# EAGLE design music_visualizer (EAGLE 7.2.0)
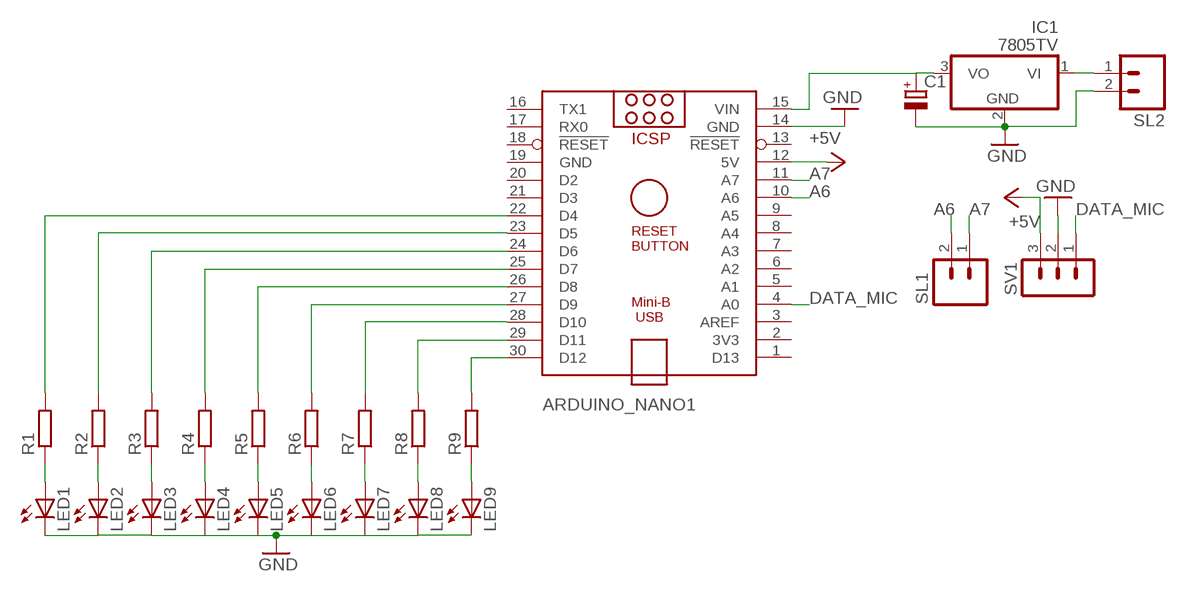
[diagram p0: schematic, sheet 1]

## Parts
ARDUINO_NANO1  ARDUINO_NANO  [ARDUINO_NANO]
C1  CPOL-EUE2.5-7  [E2,5-7]
IC1  7805TV  [TO220V]
LED1  LED5MM  [LED5MM]
LED2  LED5MM  [LED5MM]
LED3  LED5MM  [LED5MM]
LED4  LED5MM  [LED5MM]
LED5  LED5MM  [LED5MM]
LED6  LED5MM  [LED5MM]
LED7  LED5MM  [LED5MM]
LED8  LED5MM  [LED5MM]
LED9  LED5MM  [LED5MM]
R1  R-EU_0207/10  [0207/10]
R2  R-EU_0207/10  [0207/10]
R3  R-EU_0207/10  [0207/10]
R4  R-EU_0207/10  [0207/10]
R5  R-EU_0207/10  [0207/10]
R6  R-EU_0207/10  [0207/10]
R7  R-EU_0207/10  [0207/10]
R8  R-EU_0207/10  [0207/10]
R9  R-EU_0207/10  [0207/10]
SL1  M02  [02P]
SL2  M02  [02P]
SV1  MA03-1  [MA03-1]

## Nets
+5V: ARDUINO_NANO1.12(5V) SV1.3
A6: ARDUINO_NANO1.10(A6) SL1.2
A7: ARDUINO_NANO1.11(A7) SL1.1
DATA_MIC: ARDUINO_NANO1.4(A0) SV1.1
GND: ARDUINO_NANO1.14(GND) C1.- IC1.2(GND) LED1.K(C) LED2.K(C) LED3.K(C) LED4.K(C) LED5.K(C) LED6.K(C) LED7.K(C) LED8.K(C) LED9.K(C) SL2.2 SV1.2
N$1: LED1.A R1.1
N$2: ARDUINO_NANO1.30(D12) R9.2
N$3: ARDUINO_NANO1.29(D11) R8.2
N$4: ARDUINO_NANO1.28(D10) R7.2
N$5: ARDUINO_NANO1.27(D9) R6.2
N$6: ARDUINO_NANO1.26(D8) R5.2
N$7: ARDUINO_NANO1.25(D7) R4.2
N$8: ARDUINO_NANO1.24(D6) R3.2
N$9: ARDUINO_NANO1.23(D5) R2.2
N$10: ARDUINO_NANO1.22(D4) R1.2
N$11: LED2.A R2.1
N$12: LED3.A R3.1
N$13: LED4.A R4.1
N$14: LED5.A R5.1
N$15: LED6.A R6.1
N$16: LED7.A R7.1
N$17: LED8.A R8.1
N$18: LED9.A R9.1
N$19: ARDUINO_NANO1.15(VIN) C1.+ IC1.3(VO)
N$21: IC1.1(VI) SL2.1
Unconnected: ARDUINO_NANO1.1(D13) ARDUINO_NANO1.2(3V3) ARDUINO_NANO1.3(AREF) ARDUINO_NANO1.5(A1) ARDUINO_NANO1.6(A2) ARDUINO_NANO1.7(A3) ARDUINO_NANO1.8(A4) ARDUINO_NANO1.9(A5) ARDUINO_NANO1.13(!RESET) ARDUINO_NANO1.16(TX1) ARDUINO_NANO1.17(RX0) ARDUINO_NANO1.18(!RESET) ARDUINO_NANO1.20(D2) ARDUINO_NANO1.21(D3)

## Power pins joined to a net without a drawn wire
GND: ARDUINO_NANO1.19(GND)

## Library data of the parts
ARDUINO_NANO1 = ArduinoNanoV30:ARDUINO_NANO: Arduino Nano V3.0 Overview: The Arduino Nano is a small, complete, and breadboard-friendly board based on the ATmega328 (Arduino Nano 3.x) or ATmega168 (Arduino Nano 2.x). It has more or less the same functionality of the Arduino Duemilanove, but in a different package. It lacks only a DC power jack, and works with a Mini-B USB cable instead of a standard one. The Nano was designed and is being produced by Gravitech. Specifications: Microcontroller Atmel ATmega168 or ATmega328 Operating Voltage (logic level) 5 V Input Voltage (recommended) 7-12 V Input Voltage (limits) 6-20 V Digital I/O Pins 14 (of which 6 provide PWM output) Analog Input Pins 8 DC Current per I/O Pin 40 mA Flash Memory 16 KB (ATmega168) or 32 KB (ATmega328) of which 2 KB used by bootloader SRAM 1 KB (ATmega168) or 2 KB (ATmega328) EEPROM 512 bytes (ATmega168) or 1 KB (ATmega328) Clock Speed 16 MHz Dimensions 0.73" x 1.70" Length 45 mm Width 18 mm Weigth 5 g Power: The Arduino Nano can be powered via the Mini-B USB connection, 6-20V unregulated external power supply (pin 30), or 5V regulated external power supply (pin 27). The power source is automatically selected to the highest voltage source. Memory: The ATmega168 has 16 KB of flash memory for storing code (of which 2 KB is used for the bootloader); the ATmega328 has 32 KB, (also with 2 KB used for the bootloader). The ATmega168 has 1 KB of SRAM and 512 bytes of EEPROM (which can be read and written with the EEPROM library); the ATmega328 has 2 KB of SRAM and 1 KB of EEPROM. Input and Output: Each of the 14 digital pins on the Nano can be used as an input or output, using pinMode(), digitalWrite(), and digitalRead() functions. They operate at 5 volts. Each pin can provide or receive a maximum of 40 mA and has an internal pull-up resistor (disconnected by default) of 20-50 kOhms. In addition, some pins have specialized functions. Visit Arduino - ArduinoBoardNano <https://www.arduino.cc/en/Main/ArduinoBoardNano>
C1 = resistor:CPOL-EU: POLARIZED CAPACITOR, European symbol
IC1 = linear:78*: Positive VOLTAGE REGULATOR Source: http://cache.national.com/ds/LM/LM78L05.pdf http://www.fairchildsemi.com/ds/LM/LM7805.pdf
LED1-LED9 = led:LED: LED OSRAM: - CHIPLED LG R971, LG N971, LY N971, LG Q971, LY Q971, LO R971, LY R971 LH N974, LH R974 LS Q976, LO Q976, LY Q976 LO Q996 - Hyper CHIPLED LW Q18S LB Q993, LB Q99A, LB R99A - SideLED LS A670, LO A670, LY A670, LG A670, LP A670 LB A673, LV A673, LT A673, LW A673 LH A674 LY A675 LS A676, LA A676, LO A676, LY A676, LW A676 LS A679, LY A679, LG A679 - Hyper Micro SIDELED® LS Y876, LA Y876, LO Y876, LY Y876 LT Y87S - SmartLED LW L88C, LW L88S LB L89C, LB L89S, LG L890 LS L89K, LO L89K, LY L89K LS L896, LA L896, LO L896, LY L896 - TOPLED LS T670, LO T670, LY T670, LG T670, LP T670 LSG T670, LSP T670, LSY T670, LOP T670, LYG T670 LG T671, LOG T671, LSG T671 LB T673, LV T673, LT T673, LW T673 LH T674 LS T676, LA T676, LO T676, LY T676, LB T676, LH T676, LSB T676, LW T676 LB T67C, LV T67C, LT T67C, LS T67K, LO T67K, LY T67K, LW E67C LS E67B, LA E67B, LO E67B, LY E67B, LB E67C, LV E67C, LT E67C LW T67C LS T679, LY T679, LG T679 LS T770, LO T770, LY T770, LG T770, LP T770 LB T773, LV T773, LT T773, LW T773 LH T774 LS E675, LA E675, LY E675, LS T675 LS T776, LA T776, LO T776, LY T776, LB T776 LHGB T686 LT T68C, LB T68C - Hyper Mini TOPLED® LB M676 - Mini TOPLED Santana® LG M470 LS M47K, LO M47K, LY M47K Source: http://www.osram.convergy.de LUXEON: - LUMILED® LXK2-PW12-R00, LXK2-PW12-S00, LXK2-PW14-U00, LXK2-PW14-V00 LXK2-PM12-R00, LXK2-PM12-S00, LXK2-PM14-U00 LXK2-PE12-Q00, LXK2-PE12-R00, LXK2-PE12-S00, LXK2-PE14-T00, LXK2-PE14-U00 LXK2-PB12-K00, LXK2-PB12-L00, LXK2-PB12-M00, LXK2-PB14-N00, LXK2-PB14-P00, LXK2-PB14-Q00 LXK2-PR12-L00, LXK2-PR12-M00, LXK2-PR14-Q00, LXK2-PR14-R00 LXK2-PD12-Q00, LXK2-PD12-R00, LXK2-PD12-S00 LXK2-PH12-R00, LXK2-PH12-S00 LXK2-PL12-P00, LXK2-PL12-Q00, LXK2-PL12-R00 Source: www.luxeon.com KINGBRIGHT: KA-3528ASYC Source: www.kingbright.com
R1-R9 = resistor:R-EU_: RESISTOR, European symbol
SL1 SL2 = con-amp-quick:M02: AMP QUICK CONNECTOR; OC_FARNELL: unknown; OC_NEWARK: unknown
SV1 = con-lstb:MA03-1: PIN HEADER; OC_FARNELL: unknown; OC_NEWARK: unknown

## Board
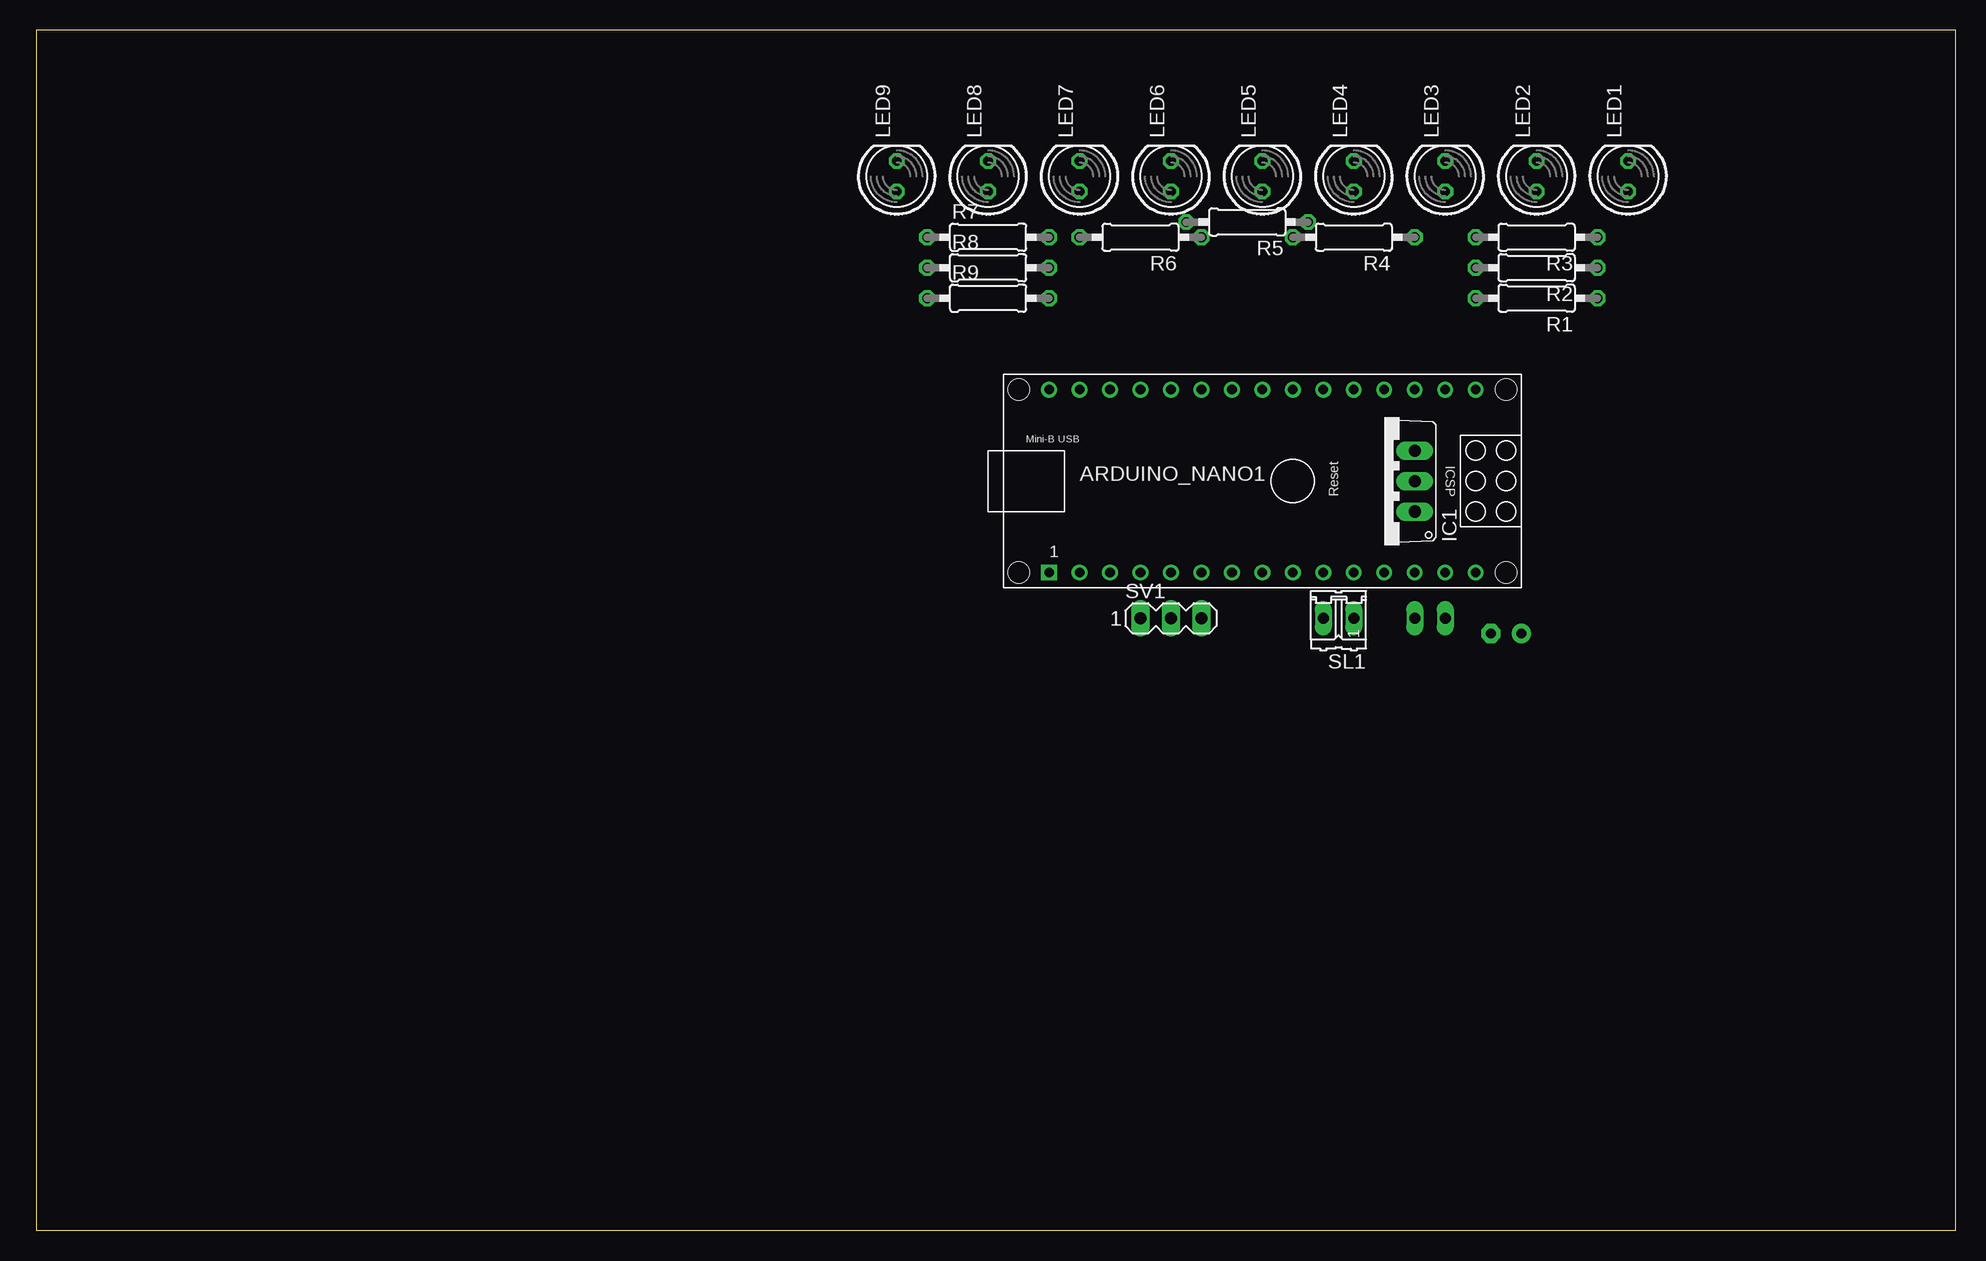
[diagram p1: board, top side]
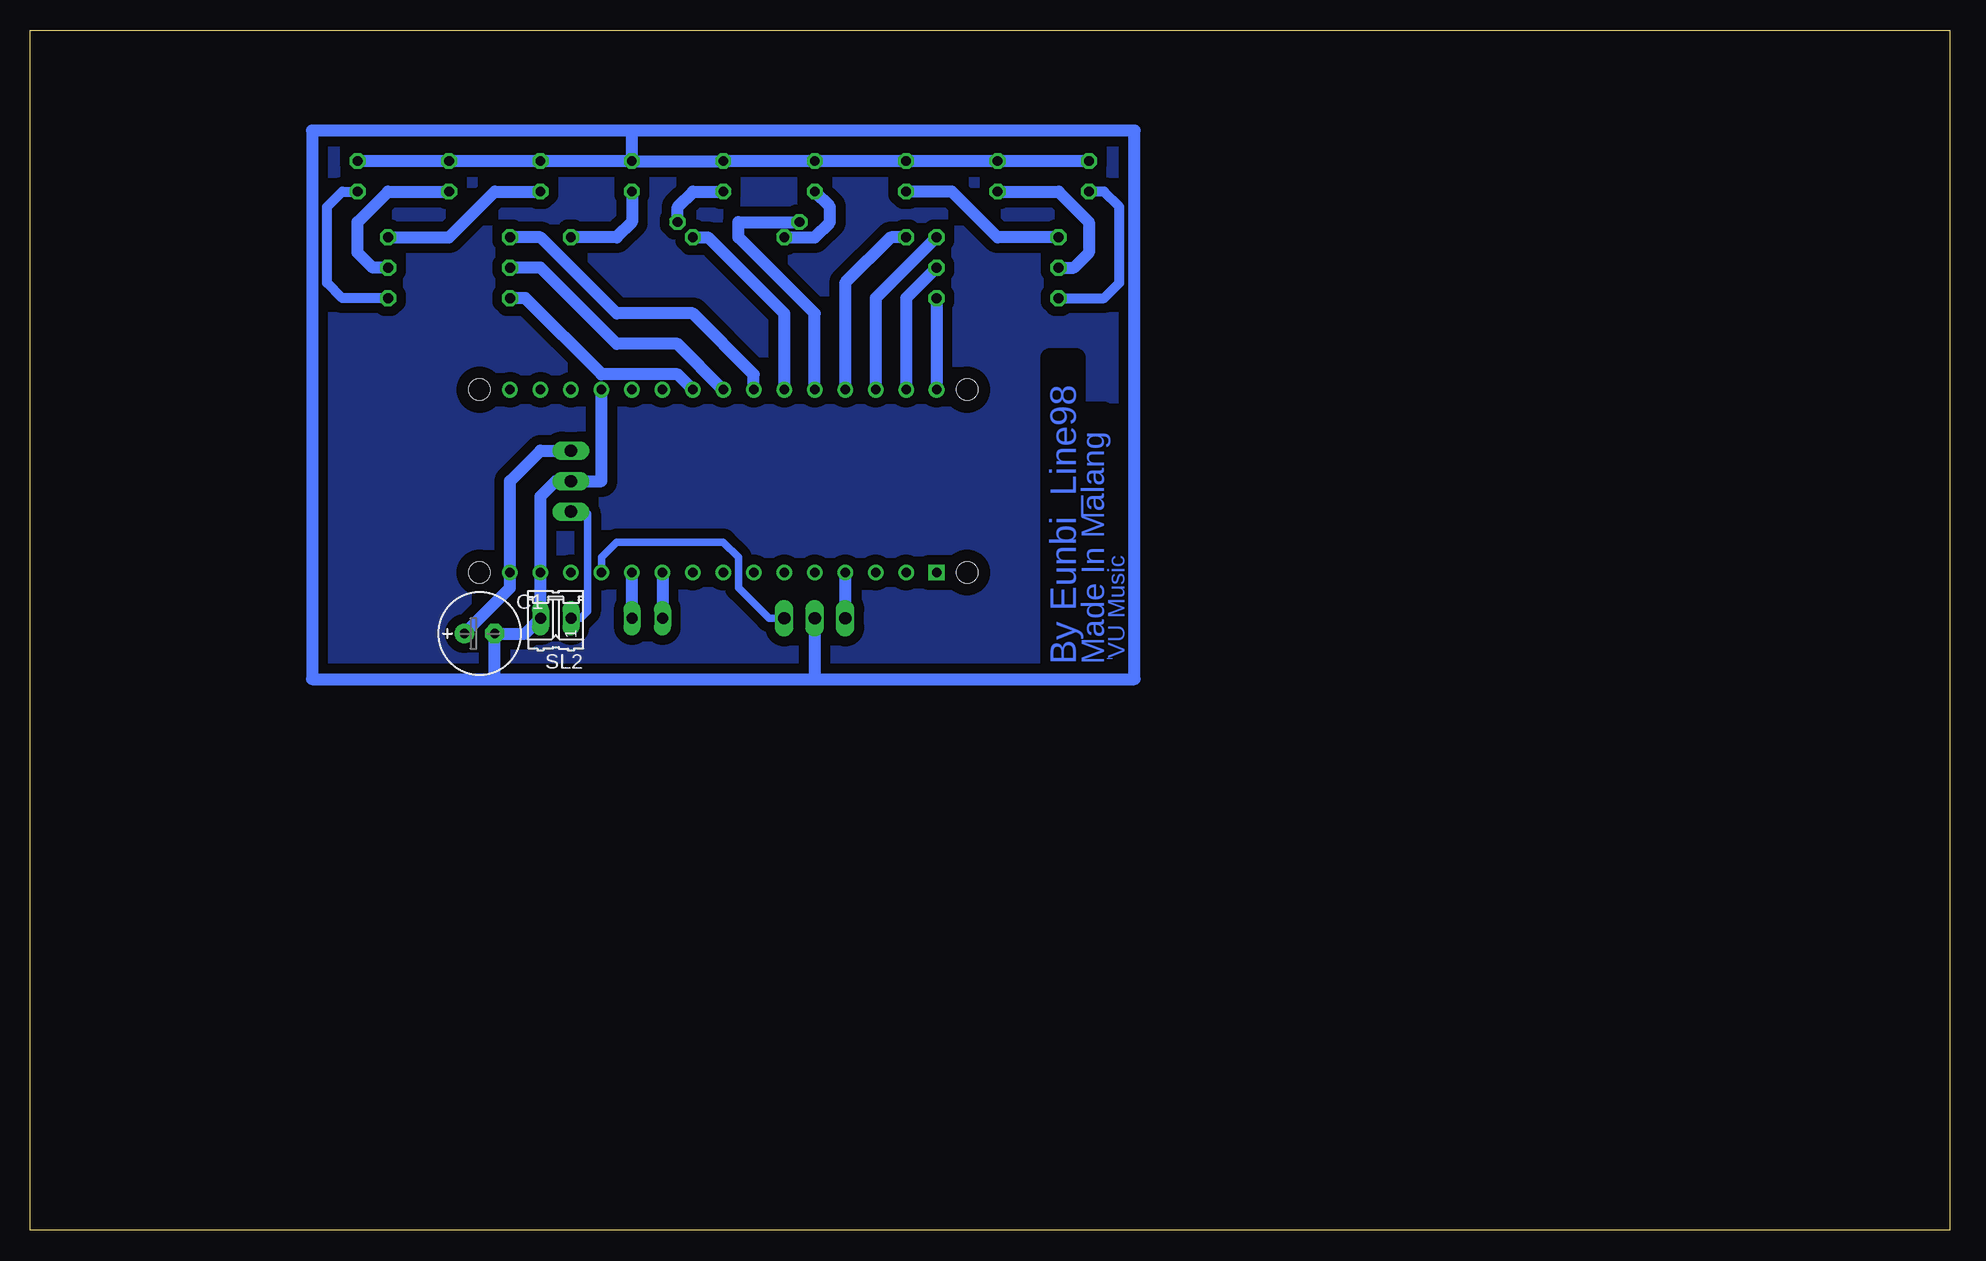
[diagram p2: board, bottom side, seen from below]

Size 160 x 100 mm. Coordinates in mm from the lower left corner, seen from the top.
Outline: 0,0 160,0 160,100 0,100 0,0
Copper layers (1*16): Top 0.035mm / dielectric 1.5mm / Bottom 0.035mm
Design rules "default": minimum track width 10mil, minimum drill 24mil, track to track 8mil, track to pad 8mil, pad to pad 8mil, via to via 8mil, smd to smd 8mil, copper to edge 40mil, drill to drill 8mil, minimum pad ring 10mil, minimum via ring 8mil, stop-mask expansion 4mil, vias tented up to drill 0mil, thermal gap 10mil

### Footprints (pad centres in the part's own frame; a part is rotated, then mirrored left to right if it is on the bottom)
ARDUINO_NANO = drill 0.8 square: 1 -20.32,-7.62 | drill 0.8: 2 -17.78,-7.62; 3 -15.24,-7.62; 4 -12.7,-7.62; 5 -10.16,-7.62; 6 -7.62,-7.62; 7 -5.08,-7.62; 8 -2.54,-7.62; 9 0,-7.62; 10 2.54,-7.62; 11 5.08,-7.62; 12 7.62,-7.62; 13 10.16,-7.62; 14 12.7,-7.62; 15 15.24,-7.62; 16 15.24,7.62; 17 12.7,7.62; 18 10.16,7.62; 19 7.62,7.62; 20 5.08,7.62; 21 2.54,7.62; 22 0,7.62; 23 -2.54,7.62; 24 -5.08,7.62; 25 -7.62,7.62; 26 -10.16,7.62; 27 -12.7,7.62; 28 -15.24,7.62; 29 -17.78,7.62; 30 -20.32,7.62 | hole 1.778: -22.86,-7.62; -22.86,7.62; 17.78,7.62; 17.78,-7.62
E2,5-7 = drill 0.813 pad 1.6: + -1.27,0 | drill 0.813 pad 1.6 octagon: - 1.27,0
TO220V = drill 1.016 long: 1 -2.54,-2.54; 2 0,-2.54; 3 2.54,-2.54
LED5MM = drill 0.813 octagon: A -1.27,0; K 1.27,0
0207/10 = drill 0.813 octagon: 1 -5.08,0; 2 5.08,0
02P = drill 0.914 long: 1 -1.27,0; 2 1.27,0
MA03-1 = drill 1.016 long: 1 -2.54,0; 2 0,0; 3 2.54,0

### Placement (x,y rotation side)
ARDUINO_NANO1  104.75,62.41 0 top
C1  122.53,49.71 0 bottom
IC1  112.37,62.41 90 top
LED1  132.69,87.81 90 top
LED2  125.07,87.81 90 top
LED3  117.45,87.81 90 top
LED4  109.83,87.81 90 top
LED5  102.21,87.81 90 top
LED6  94.59,87.81 90 top
LED7  86.97,87.81 90 top
LED8  79.35,87.81 90 top
LED9  71.73,87.81 90 top
R1  125.07,77.65 180 top
R2  125.07,80.19 180 top
R3  125.07,82.73 180 top
R4  109.83,82.73 180 top
R5  100.94,84 180 top
R6  92.05,82.73 180 top
R7  79.35,82.73 0 top
R8  79.35,80.19 0 top
R9  79.35,77.65 0 top
SL1  108.56,50.98 180 top
SL2  116.18,50.98 180 bottom
SV1  94.59,50.98 0 top

### Tracks (layer width: path | path; a pad name or v marks a point on that pad's centre or on a via)
+5V
  Bottom 0.61: SV1.3 98.4,50.98 100.94,53.52 100.94,56.06 102.21,57.33 111.1,57.33 112.37,56.06 ARDUINO_NANO1.12
A6
  Bottom 1.016: ARDUINO_NANO1.10 SL1.2
A7
  Bottom 1.016: SL1.1 ARDUINO_NANO1.11
DATA_MIC
  Bottom 1.016: ARDUINO_NANO1.4 SV1.1
GND
  Bottom 1.016: LED9.K LED8.K LED7.K LED6.K LED5.K LED4.K | LED4.K LED3.K LED2.K LED1.K | LED4.K 109.83,91.62 | 109.83,91.62 136.5,91.62 136.5,45.9 121.26,45.9 | 121.26,45.9 C1.- 118.72,49.71 SL2.2 ARDUINO_NANO1.14 117.45,61.14 116.18,62.41 IC1.2 112.37,62.41 ARDUINO_NANO1.19 | 121.26,45.9 94.59,45.9 | 94.59,45.9 67.92,45.9 67.92,91.62 109.83,91.62 | SV1.2 94.59,45.9
N$1
  Bottom 0.813: R1.1 133.96,77.65 135.23,78.92 135.23,85.27 133.96,86.54 LED1.A
N$2
  Bottom 1.016: R9.2 ARDUINO_NANO1.30
N$3
  Bottom 1.016: R8.2 86.97,77.65 ARDUINO_NANO1.29
N$4
  Bottom 1.016: R7.2 89.51,77.65 ARDUINO_NANO1.28
N$5
  Bottom 1.016: R6.2 88.24,82.73 92.05,78.92 ARDUINO_NANO1.27
N$6
  Bottom 1.016: ARDUINO_NANO1.26 94.59,76.38 100.94,82.73 100.94,84 R5.2
N$7
  Bottom 1.016: R4.2 103.48,82.73 97.13,76.38 ARDUINO_NANO1.25
N$8
  Bottom 1.016: ARDUINO_NANO1.24 99.67,71.3 104.75,76.38 111.1,76.38 117.45,82.73 R3.2
N$9
  Bottom 1.016: ARDUINO_NANO1.23 106.02,73.84 111.1,73.84 117.45,80.19 R2.2
N$10
  Bottom 1.016: ARDUINO_NANO1.22 106.02,71.3 112.37,71.3 118.72,77.65 R1.2
N$11
  Bottom 1.016: R2.1 131.42,80.19 132.69,81.46 132.69,84 130.15,86.54 LED2.A
N$12
  Bottom 1.016: R3.1 125.07,82.73 121.26,86.54 LED3.A
N$13
  Bottom 1.016: LED4.A 109.83,84 111.1,82.73 R4.1
N$14
  Bottom 1.016: R5.1 106.02,85.27 104.75,86.54 LED5.A
N$15
  Bottom 1.016: R6.1 94.59,82.73 93.32,84 93.32,85.27 LED6.A
N$16
  Bottom 1.016: R7.1 79.35,82.73 83.16,86.54 LED7.A
N$17
  Bottom 1.016: LED8.A 74.27,86.54 71.73,84 71.73,81.46 73,80.19 R8.1
N$18
  Bottom 0.813: R9.1 70.46,77.65 69.19,78.92 69.19,85.27 70.46,86.54 LED9.A
N$19
  Bottom 1.016: IC1.3 117.45,64.95 119.99,62.41 ARDUINO_NANO1.15 119.99,53.52 C1.+
N$20
  pour Bottom (isolate 0.813): 67.92,91.62 67.92,45.9 136.5,45.9 136.5,91.62
N$21
  Bottom 0.61: SL2.1 114.12,50.98 113.54,51.56 113.54,59.69 113.72,59.87 IC1.1
(copper drawn outside any net)
  shapes: Bottom area x113

### Text on the board
Bottom: VU Music | Made In Malang | By Eunbi_Line98 | F:/pidi_uts/Untitled-1.bmp